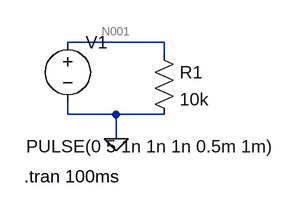
[diagram p0: schematic Draft1.asc]
Draft1.asc, the LTspice schematic file:
Version 4
SHEET 1 880 680
WIRE 288 80 160 80
WIRE 288 96 288 80
WIRE 160 176 160 160
WIRE 224 176 160 176
WIRE 288 176 224 176
WIRE 224 208 224 176
FLAG 224 208 0
SYMBOL voltage 160 64 R0
WINDOW 3 -55 154 Left 2
WINDOW 123 0 0 Left 0
WINDOW 39 0 0 Left 0
SYMATTR InstName V1
SYMATTR Value PULSE(0 5 1n 1n 1n 0.5m 1m)
SYMBOL res 272 80 R0
SYMATTR InstName R1
SYMATTR Value 10k
TEXT 102 258 Left 2 !.tran 100ms

The netlist it stands for:
* Draft1.asc
V1 N001 0 PULSE(0 5 1n 1n 1n 0.5m 1m)
R1 N001 0 10k
.tran 100ms
.backanno
.end

* Results of the author's LTspice run, read from the files saved beside the schematic
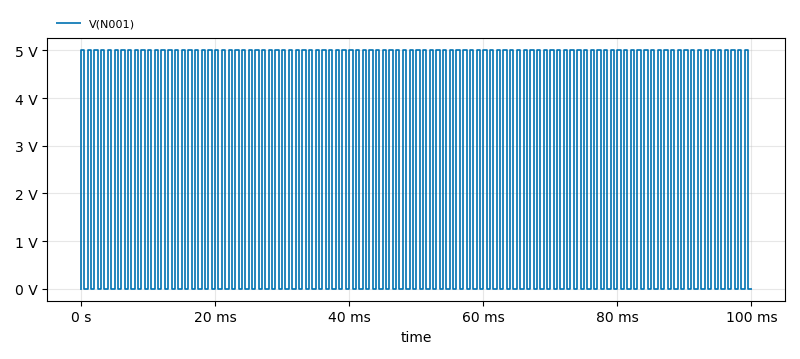
[diagram p1: Transient Analysis of Draft1.asc, plotted from the saved traces]
* Transient Analysis, 1 run:
*   V(N001): min 0 V, max 5 V, average 2.5 V, rms 3.536 V, last 0 V